# Altium schematic sheet Sheet1.SchDoc
size A2
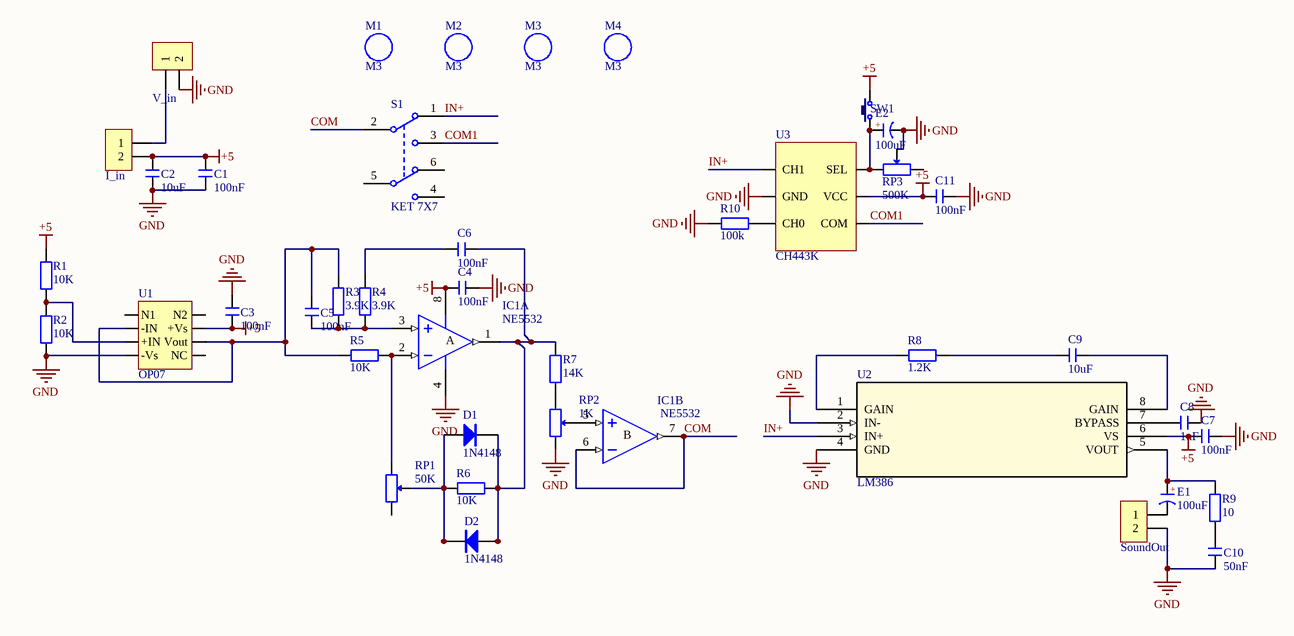
[diagram p0: Sheet1.SchDoc]

## Parts
C1  100nF  [C 0603_L]
C2  10uF  [C 0603_L]
C3  100nF  [C 0603_L]
C4  100nF  [C 0603_L]
C5  100nF  [C 0603_L]
C6  100nF  [C 0603_L]
C7  100nF  [C 0603_L]
C8  1uF  [C 0603_L]
C9  10uF  [C 0603_L]
C10  50nF  [C 0603_L]
C11  100nF  [C 0603_L]
D1  1N4148  [MINI_MELF (LL34)]
D2  1N4148  [MINI_MELF (LL34)]
E1  100uF  [CAP 2.5*6.3*7]
E2  100uF  [CAP 2.5*6.3*7]
I_in  HDR-1X2  [HDR2.54-LI-2P]  (value not drawn)
IC1  NE5532  [SOP8_L]  (parts A,B of 2)
M1  M3  [M3 125X200]
M2  M3  [M3 125X200]
M3  M3  [M3 125X200]
M4  M3  [M3 125X200]
R1  10K  [R 0603_L]
R2  10K  [R 0603_L]
R3  3.9K  [R 0603_L]
R4  3.9K  [R 0603_L]
R5  10K  [R 0603_L]
R6  10K  [R 0603_L]
R7  14K  [R 0603_L]
R8  1.2K  [R 0603_L]
R9  10  [R 0603_L]
R10  100k  [R 0603_L]
RP1  50K  [3296W]
RP2  1K  [3296W]
RP3  500K  [3296W]
S1  KET 7X7  [KFT DIP-7X7]
SoundOut  HDR-1X2  [HDR2.54-LI-2P]  (value not drawn)
SW1  3x6x5  [TSW SMD-3*6*2.5]  (value not drawn)
U1  OP07  [SOIC-8_L]
U2  LM386  [SOP8_L]
U3  CH443K  [SOT65P230X110-6N]
V_in  HDR-1X2  [HDR2.54-LI-2P]  (value not drawn)

## Nets
+5: C1.2 C2.2 C3.1 C4.2 C7.1 C11.2 I_in.2 IC1.8(V+) R1.2 SW1.2 U1.7(+Vs) U2.6(VS) U3.5(VCC)
GND: C1.1 C2.1 C3.2 C4.1 C7.2 C8.2 C10.1 C11.1 E2.2(K) IC1.4(V-) R2.1 R10.1 RP2.1 RP3.2 SoundOut.2 U1.4(-Vs) U2.2(IN-) U2.4(GND) U3.2(GND) V_in.2
COM: IC1.6(IN-) IC1.7(OUT) S1.2(COM2)
COM1: S1.3(NO1) U3.4(COM)
IN+: S1.1(NC1) U2.3(IN+) U3.1(CH1)
NetC5_1: C5.1 R3.2 R5.2 U1.2(-IN) U1.6(Vout)
NetC5_2: C5.2 IC1.3(IN+) R3.1 R4.1
NetC6_1: C6.1 R4.2
NetC6_2: C6.2 D1.2(K) D2.1(A) IC1.1(OUT) R6.1 R7.1
NetC8_1: C8.1 U2.7(BYPASS)
NetC9_1: C9.1 R8.2
NetC9_2: C9.2 U2.8(GAIN)
NetC10_2: C10.2 R9.1
NetD1_1: D1.1(A) D2.2(K) R6.2 RP1.2
NetE1_1: E1.1(A) R9.2 U2.5(VOUT)
NetE1_2: E1.2(K) SoundOut.1
NetE2_1: E2.1(A) RP3.1 SW1.1 U3.6(SEL)
NetI_in_1: I_in.1 V_in.1
NetIC1_2: IC1.2(IN-) R5.1 RP1.1
NetIC1_5: IC1.5(IN+) RP2.2
NetR1_1: R1.1 R2.2 U1.3(+IN)
NetR7_2: R7.2 RP2.3
NetR8_1: R8.1 U2.1(GAIN)
NetR10_2: R10.2 U3.3(CH0)

Not connected (* = marked no-connect by the designer): RP1 3; RP3 3; S1 4(NO2) 5(COM2) 6(NC2); U1 1(N1) 5(NC) 8(N2)

## Notes on the sheet
- (in symbol C-CAP) +
- (in symbol NE5532, part A) A
- (in symbol NE5532, part B) B

## Library data of the parts
C1-C11 = C: 无极性贴片电容; 版权归属: 源创客; BOM名称: 无极性贴片电容; 学习资源: www.ooocke.com
D1 D2 = 1N4148: 高速开关二极管; 版权归属: 源创客; BOM名称: 高速开关二极管; 学习资源: www.ooocke.com
E1 E2 = C-CAP: 直插电解电容; 版权归属: 源创客; BOM名称: 直插电解电容; 学习资源: www.ooocke.com
I_in SoundOut V_in = Header 2: 2P接插件; 版权归属: 源创客; BOM名称: 2P接插件; 学习资源: www.ooocke.com
IC1 = NE5532: 双路低噪声音频运放; 版权归属: 源创客; BOM名称: 双路低噪声音频运放; 学习资源: www.ooocke.com
M1-M4 = M3: 铜柱孔; 版权归属: 源创客; BOM名称: 铜柱孔; 学习资源: www.ooocke.com
R1-R10 = R: 贴片电阻; 版权归属: 源创客; BOM名称: 贴片电阻; 学习资源: www.ooocke.com
RP1-RP3 = RP-ID: 插件单联电位器; BOM名称: 插件电位器; 版权归属: 源创客; 学习资源: www.ooocke.com
S1 = KET 7X7: 7*7自锁开关; 版权归属: 源创客; BOM名称: 7*7自锁开关; 学习资源: www.ooocke.com
SW1 = TSW 3x6: 3x6轻触开关; 版权归属: 源创客; BOM名称: 3x6轻触开关; 学习资源: www.ooocke.com
U1 = OP07: Ultra-Low Offset Voltage Operational Amplifier; Note: Pin 5 is not connected.; Published: 8-Jun-2000; LatestRevisionDate: 13-Apr-2006; LatestRevisionNote: IPC-7351 Footprint Added.; DatasheetVersion: 1992; PackageVersion: revA; PackageReference: SO-8; Publisher: Altium Limited; PackageDescription: 8-Pin Small Outline Integrated Circuit 1.27 mm Pitch; Code_JEDEC: MS-012-AA; Code_IPC: SOIC127P600-8; ComponentLink1Description: Manufacturer Link; ComponentLink1URL: http://www.analog.com/en/prod/0,,759_786_OP07%2C00.html; ComponentLink2Description: Datasheet; ComponentLink2URL: http://www.analog.com/UploadedFiles/Data_Sheets/39161232478959OP07_c.pdf
U2 = LM386: 700mW音频功放; Mfr_Name: Texas Instruments; Manufacturer_Part_Number: LM386M-1/NOPB; Copyright: Copyright (C) 2021 Ultra Librarian. All rights reserved.; RefDes: RefDes; Type: DEV